# EAGLE design Slave Board (EAGLE 9.0.1)
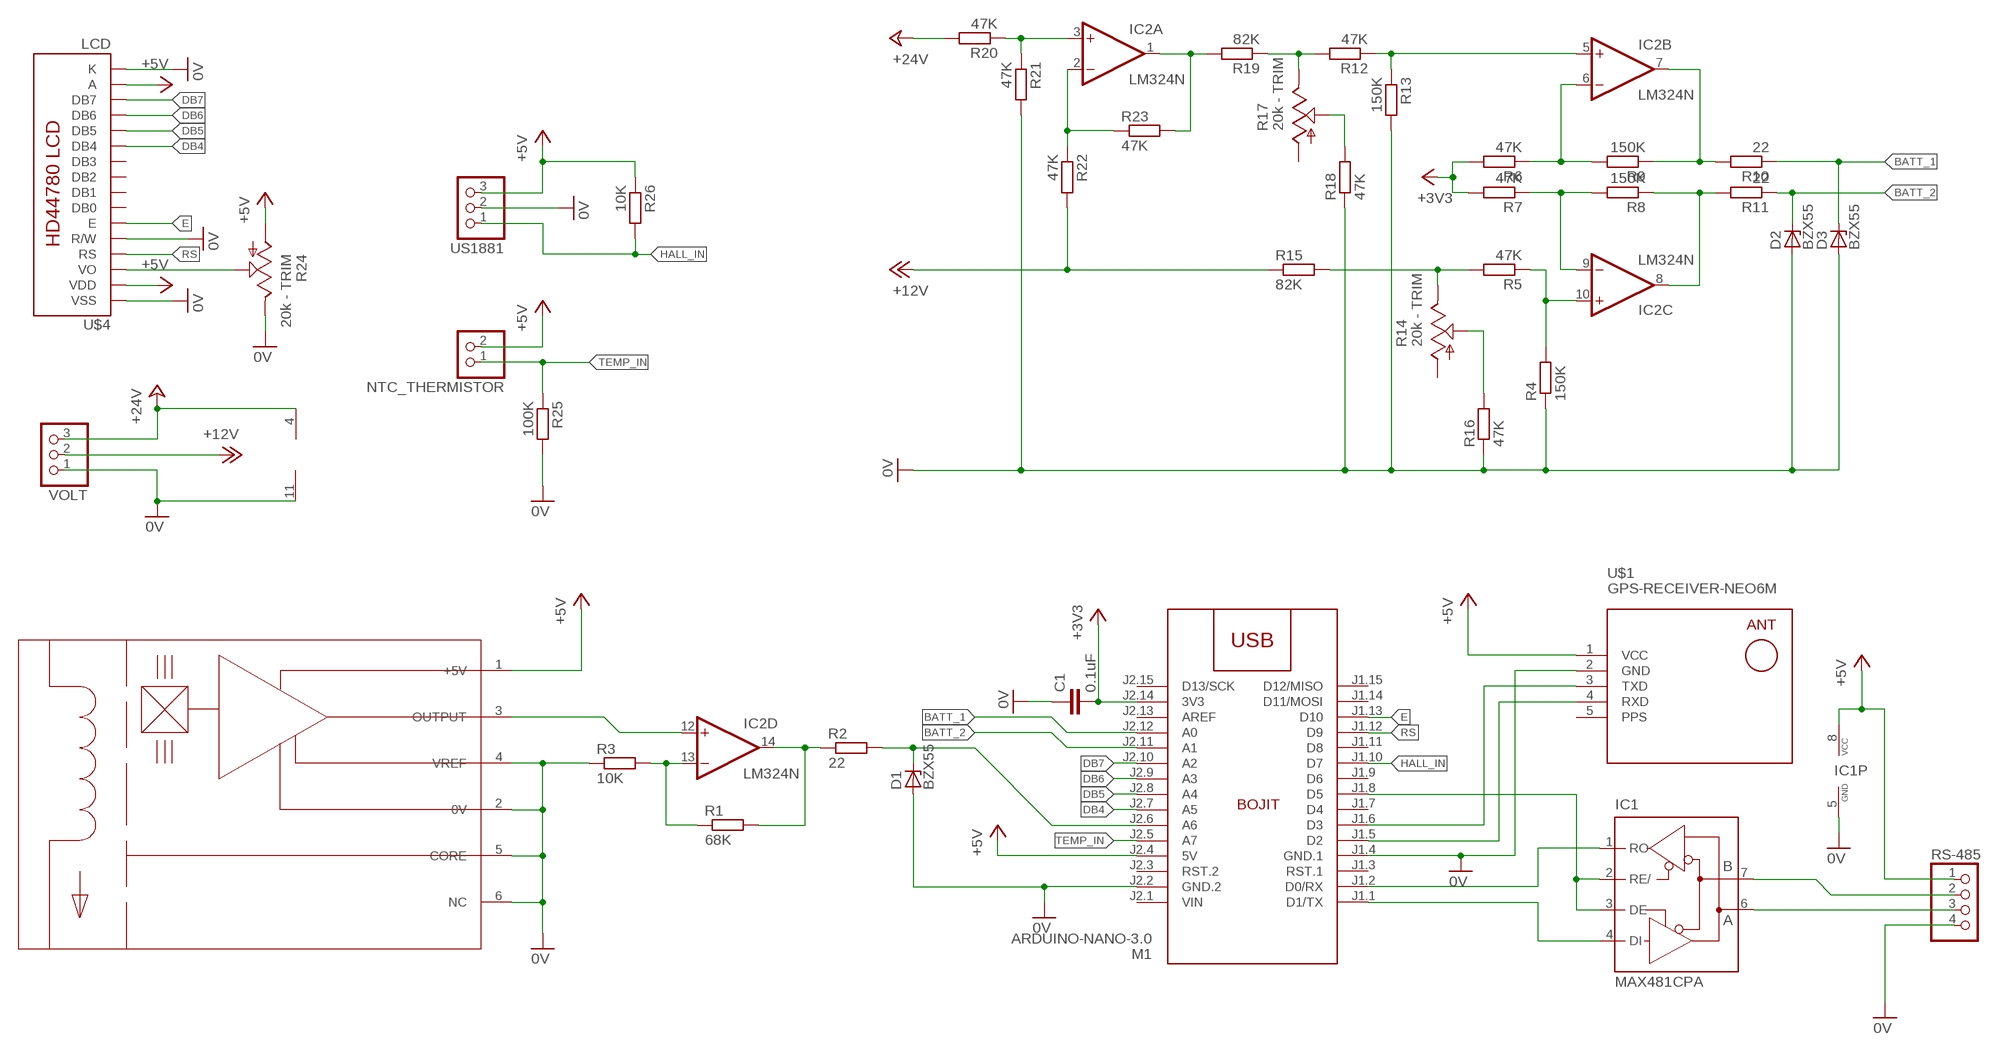
[diagram p0: schematic, sheet 1]

## Parts
C1  0.1uF  C-EU050-030X075  [C050-030X075]
D1  BZX55  [DO35Z10]
D2  BZX55  [DO35Z10]
D3  BZX55  [DO35Z10]
IC1  MAX481CPA  [DIL08]
IC2  LM324N  [DIL14]
M1  ARDUINO-NANO-3.0  [ARDUINO-NANO-3.0]
NTC_THERMISTOR  PINHD-1X2/90  [1X02/90]
R1  68K  R-EU_0204/7  [0204/7]
R2  22  R-EU_0204/7  [0204/7]
R3  10K  R-EU_0204/7  [0204/7]
R4  150K  R-EU_0204/7  [0204/7]
R5  47K  R-EU_0204/7  [0204/7]
R6  47K  R-EU_0204/7  [0204/7]
R7  47K  R-EU_0204/7  [0204/7]
R8  150K  R-EU_0204/7  [0204/7]
R9  150K  R-EU_0204/7  [0204/7]
R10  22  R-EU_0204/7  [0204/7]
R11  22  R-EU_0204/7  [0204/7]
R12  47K  R-EU_0204/7  [0204/7]
R13  150K  R-EU_0204/7  [0204/7]
R14  20k - TRIM  TRIM_US-CA9V  [CA9V]
R15  82K  R-EU_0204/7  [0204/7]
R16  47K  R-EU_0204/7  [0204/7]
R17  20k - TRIM  TRIM_US-CA9V  [CA9V]
R18  47K  R-EU_0204/7  [0204/7]
R19  82K  R-EU_0204/7  [0204/7]
R20  47K  R-EU_0204/7  [0204/7]
R21  47K  R-EU_0204/7  [0204/7]
R22  47K  R-EU_0204/7  [0204/7]
R23  47K  R-EU_0204/7  [0204/7]
R24  20k - TRIM  TRIM_US-CA9V  [CA9V]
R25  100K  R-EU_0204/7  [0204/7]
R26  10K  R-EU_0204/7  [0204/7]
RS-485  PINHD-1X4/90  [1X04/90]
U$1  GPS-RECEIVER-NEO6M  [GPS-RECEIVER-NEO6M]
U$2  LEM_50-P  [LEM_50-P]
U$3  BOJIT_LARGE  [BOJIT_LARGE]
U$4  LCD  LCD-HD447804-HOLES16X2-4-HOLES  [LCD-16X2-4HOLES]
US1881  PINHD-1X3/90  [1X03/90]
VOLT  PINHD-1X3/90  [1X03/90]

## Nets
0V: C1.1 D1.A D2.A D3.A IC1.5(GND) IC2.11(P:V-) M1.J1.4(GND.1) M1.J2.2(GND.2) R3.1 R4.1 R13.2 R16.1 R18.1 R21.2 R24.E R25.2 RS-485.4 U$1.2(GND) U$2.2(0V) U$2.4(VREF) U$2.5(CORE) U$2.6(NC) U$4.1(VSS) U$4.5(R/W) U$4.16(K) US1881.2 VOLT.1
+3V3: C1.2 M1.J2.14(3V3) R6.2 R7.2
+5V: IC1.8(VCC) M1.J2.4(5V) NTC_THERMISTOR.2 R24.A R26.1 RS-485.1 U$1.1(VCC) U$2.1(+5V) U$4.2(VDD) U$4.15(A) US1881.3
+12V: R15.1 R22.2 VOLT.2
+24V: IC2.4(P:V+) R20.2 VOLT.3
BATT_1: D3.C M1.J2.12(A0) R10.1
BATT_2: D2.C M1.J2.11(A1) R11.1
DB4: M1.J2.7(A5) U$4.11(DB4)
DB5: M1.J2.8(A4) U$4.12(DB5)
DB6: M1.J2.9(A3) U$4.13(DB6)
DB7: M1.J2.10(A2) U$4.14(DB7)
E: M1.J1.13(D10) U$4.6(E)
HALL_IN: M1.J1.10(D7) R26.2 US1881.1
N$1: IC1.6(A) RS-485.3
N$2: IC1.7(B) RS-485.2
N$4: R24.S U$4.3(VO)
N$5: IC1.2(RE/) IC1.3(DE) M1.J1.8(D5)
N$6: IC1.1(RO) M1.J1.2(D0/RX)
N$7: IC1.4(DI) M1.J1.1(D1/TX)
N$8: M1.J1.5(D2) U$1.4(RXD)
N$9: M1.J1.6(D3) U$1.3(TXD)
N$10: IC2.13(D:-IN) R1.1 R3.2
N$11: IC2.14(D:OUT) R1.2 R2.1
N$12: IC2.12(D:+IN) U$2.3(OUTPUT)
N$13: D1.C M1.J2.6(A6) R2.2
N$14: IC2.7(B:OUT) R9.1 R10.2
N$15: IC2.8(C:OUT) R8.1 R11.2
N$16: R14.S R16.2
N$17: IC2.9(C:-IN) R7.1 R8.2
N$18: IC2.6(B:-IN) R6.1 R9.2
N$19: IC2.10(C:+IN) R4.2 R5.1
N$20: IC2.5(B:+IN) R12.1 R13.1
N$21: R12.2 R17.E R19.1
N$22: R5.2 R14.E R15.2
N$23: R17.S R18.2
N$24: IC2.1(A:OUT) R19.2 R23.2
N$25: IC2.2(A:-IN) R22.1 R23.1
N$27: IC2.3(A:+IN) R20.1 R21.1
RS: M1.J1.12(D9) U$4.4(RS)
TEMP_IN: M1.J2.5(A7) NTC_THERMISTOR.1 R25.1
Unconnected: M1.J1.3(RST.1) M1.J1.7(D4) M1.J1.9(D6) M1.J1.11(D8) M1.J1.14(D11/MOSI) M1.J1.15(D12/MISO) M1.J2.3(RST.2) M1.J2.13(AREF) M1.J2.15(D13/SCK) R14.A R17.A U$4.7(DB0) U$4.8(DB1) U$4.9(DB2) U$4.10(DB3)

## Power pins joined to a net without a drawn wire
PPS: U$1.5(PPS)
VIN: M1.J2.1(VIN)

## Library data of the parts
C1 = rcl:C-EU: CAPACITOR, European symbol; SPICEPREFIX: C
D1-D3 = diode:BZX55: Z DIODE
IC1 = maxim:MAX481CPA: RS485 TRANSEIVER; MPN: MAX481CPA+; OC_FARNELL: unknown; OC_NEWARK: 99K3445
IC2 = linear:LM324: OP AMP
M1 = diy-modules:ARDUINO-NANO-3.0: Arduino Nano 3.0 and compatible devices More details available here: https://www.arduino.cc/en/Main/ArduinoBoardNano Click here to find device on ebay.com <http://www.ebay.com/sch/arduino+nano>
NTC_THERMISTOR = pinhead:PINHD-1X2: PIN HEADER
R1-R13 R15 R16 R18-R23 R25 R26 = rcl:R-EU_: RESISTOR, European symbol; SPICEPREFIX: R
R14 R17 R24 = pot:TRIM_US-: POTENTIOMETER
RS-485 = pinhead:PINHD-1X4: PIN HEADER
U$1 = diy-modules:GPS-RECEIVER-NEO6M: GPS Receiver Module based on NEO-6 device Short tutorial how to use NEO-6 module with Arduino: http://www.xarg.org/2016/06/neo6mv2-gps-module-with-arduino/ NEO-6 datasheet is available here: https://www.u-blox.com/sites/default/files/products/documents/NEO-6_DataSheet_%28GPS.G6-HW-09005%29.pdf Click here to find device on ebay.com <http://www.ebay.com/sch/gyneo6mv2>
U$2 = LEM_50-P:LEM_50-P
U$3 = BOJIT Logos:BOJIT_LARGE
U$4 = HD44780LCD:LCD-HD44780
US1881 VOLT = pinhead:PINHD-1X3: PIN HEADER

## Board
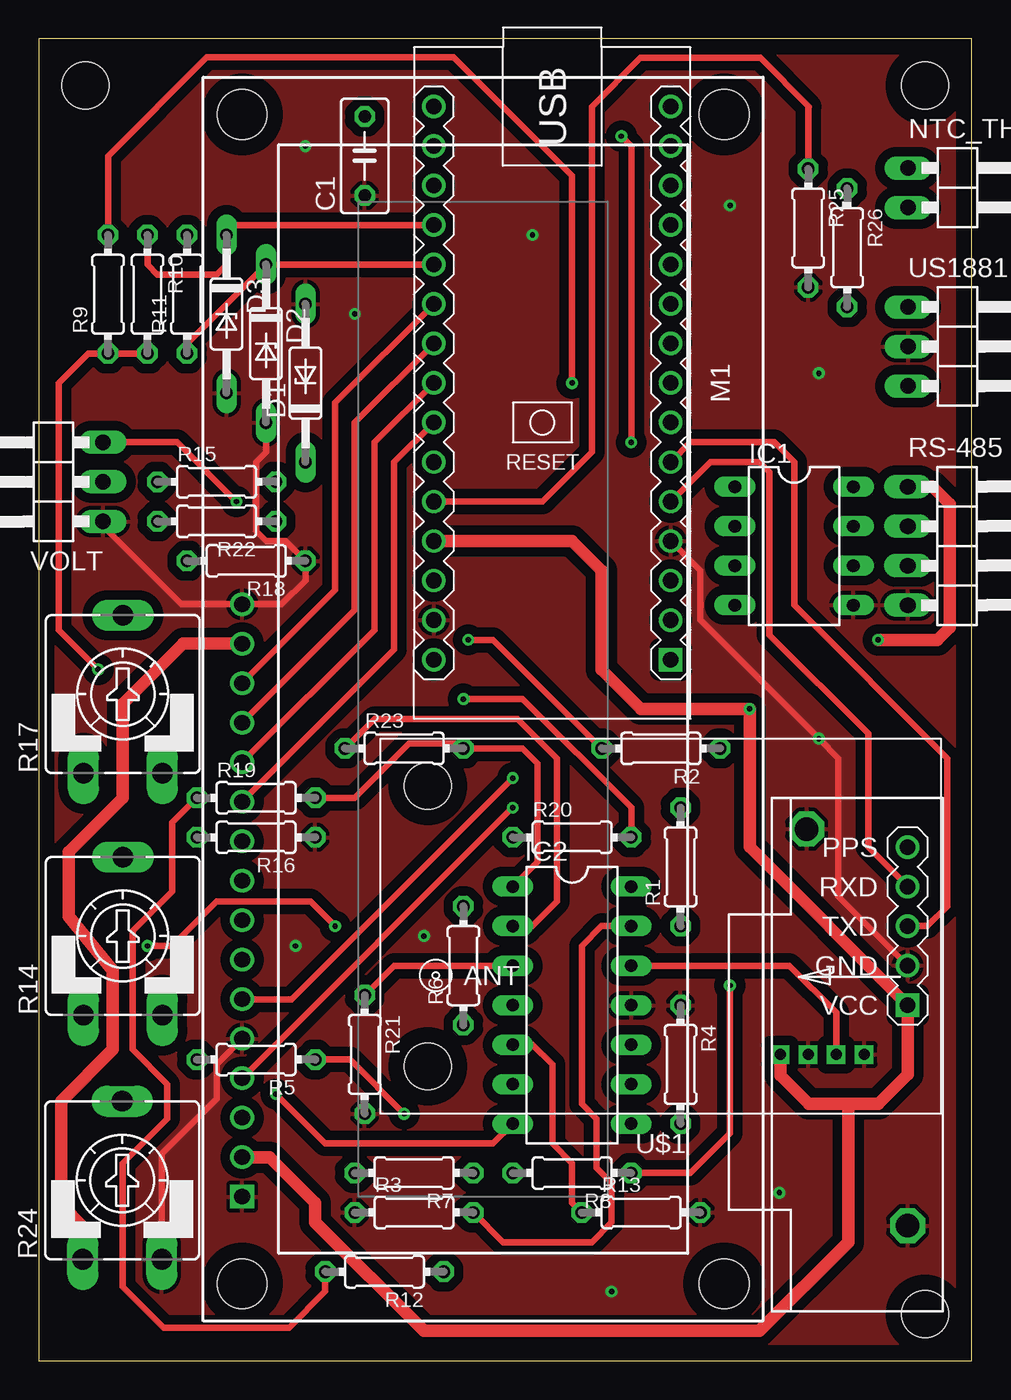
[diagram p1: board, top side]
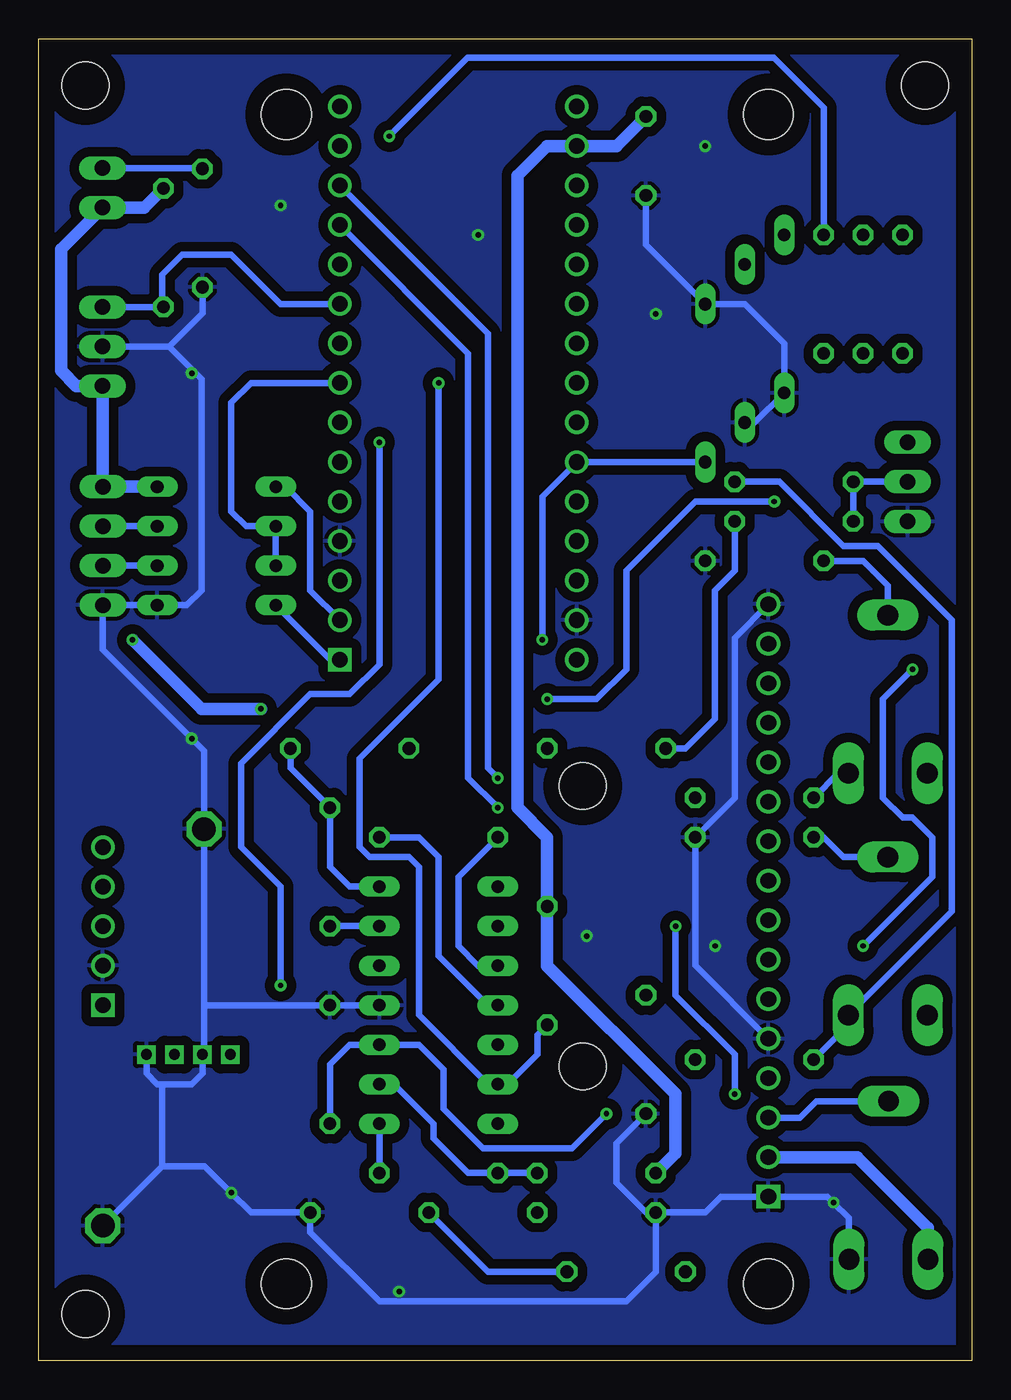
[diagram p2: board, bottom side, seen from below]

Size 60 x 85 mm. Coordinates in mm from the lower left corner, seen from the top.
Outline: 0,0 60,0 60,85 0,85 0,0
Copper layers (1*16): Top 0.035mm / dielectric 1.5mm / Bottom 0.035mm
Design rules "default": minimum track width 6mil, minimum drill 0.35mm, track to track 6mil, track to pad 6mil, pad to pad 6mil, via to via 6mil, smd to smd 6mil, copper to edge 40mil, drill to drill 6mil, minimum pad ring 10mil, minimum via ring 8mil, stop-mask expansion 4mil, vias tented up to drill 0mil, thermal gap 10mil
Holes 3 mm at 3,82 57,3 57,82

### Footprints (pad centres in the part's own frame; a part is rotated, then mirrored left to right if it is on the bottom)
C050-030X075 = drill 0.813 octagon: 1 -2.54,0; 2 2.54,0
DO35Z10 = drill 0.813 long: A 5.08,0; C -5.08,0
DIL08 = drill 0.813 long: 1 -3.81,-3.81; 2 -1.27,-3.81; 3 1.27,-3.81; 4 3.81,-3.81; 5 3.81,3.81; 6 1.27,3.81; 7 -1.27,3.81; 8 -3.81,3.81
DIL14 = drill 0.813 long: 1 -7.62,-3.81; 2 -5.08,-3.81; 3 -2.54,-3.81; 4 0,-3.81; 5 2.54,-3.81; 6 5.08,-3.81; 7 7.62,-3.81; 8 7.62,3.81; 9 5.08,3.81; 10 2.54,3.81; 11 0,3.81; 12 -2.54,3.81; 13 -5.08,3.81; 14 -7.62,3.81
ARDUINO-NANO-3.0 = drill 1 square: J1.1 17.78,7.62 | drill 1: J1.2 15.24,7.62; J1.3 12.7,7.62; J1.4 10.16,7.62; J1.5 7.62,7.62; J1.6 5.08,7.62; J1.7 2.54,7.62; J1.8 0,7.62; J1.9 -2.54,7.62; J1.10 -5.08,7.62; J1.11 -7.62,7.62; J1.12 -10.16,7.62; J1.13 -12.7,7.62; J1.14 -15.24,7.62; J1.15 -17.78,7.62; J2.1 17.78,-7.62; J2.2 15.24,-7.62; J2.3 12.7,-7.62; J2.4 10.16,-7.62; J2.5 7.62,-7.62; J2.6 5.08,-7.62; J2.7 2.54,-7.62; J2.8 0,-7.62; J2.9 -2.54,-7.62; J2.10 -5.08,-7.62; J2.11 -7.62,-7.62; J2.12 -10.16,-7.62; J2.13 -12.7,-7.62; J2.14 -15.24,-7.62; J2.15 -17.78,-7.62
1X02/90 = drill 1.016 long: 1 -1.27,-3.81; 2 1.27,-3.81
0204/7 = drill 0.813 octagon: 1 -3.81,0; 2 3.81,0
CA9V = drill 1.321 long: A -2.54,-5.08; E 2.54,-5.08; S 0,5.08
1X04/90 = drill 1.016 long: 1 -3.81,-3.81; 2 -1.27,-3.81; 3 1.27,-3.81; 4 3.81,-3.81
GPS-RECEIVER-NEO6M = drill 1 square: 1 -15.875,5.08 | drill 1: 2 -15.875,2.54; 3 -15.875,0; 4 -15.875,-2.54; 5 -15.875,-5.08 | hole 3: 14.986,-9.017; 14.986,9.017
LEM_50-P = drill 0.7 square: 1 0,8.2; 2 0,6.4; 3 0,4.6; 4 0,2.8 | drill 1.5 octagon: 5 -11,0; 6 14.5,6.5
LCD-16X2-4HOLES = drill 1.016 square: 1 -32,15.5 | drill 1.016: 2 -29.46,15.5; 3 -26.92,15.5; 4 -24.38,15.5; 5 -21.84,15.5; 6 -19.3,15.5; 7 -16.76,15.5; 8 -14.22,15.5; 9 -11.68,15.5; 10 -9.14,15.5; 11 -6.6,15.5; 12 -4.06,15.5; 13 -1.52,15.5; 14 1.02,15.5; 15 3.56,15.5; 16 6.1,15.5 | hole 3.2: -37.6,15.5; -37.6,-15.5; 37.6,-15.5; 37.6,15.5
1X03/90 = drill 1.016 long: 1 -2.54,-3.81; 2 0,-3.81; 3 2.54,-3.81

### Placement (x,y rotation side)
C1  20.95,77.47 90 top
D1  17.14,62.87 90 top
D2  14.61,65.41 270 top
D3  12.06,67.31 270 top
IC1  48.58,52.39 270 top
IC2  34.29,22.86 270 top
M1  33.02,62.87 270 top
NTC_THERMISTOR  59.72,75.43 270 top
R1  41.27,31.75 90 top
R2  40.01,39.37 180 top
R3  24.13,9.53 0 top
R4  41.27,19.05 270 top
R5  13.97,19.37 180 top
R6  27.3,25.4 90 top
R7  24.13,12.06 180 top
R8  34.29,12.06 180 top
R9  4.45,68.58 90 top
R10  6.99,68.58 270 top
R11  9.53,68.58 90 top
R12  22.23,5.71 180 top
R13  38.73,9.53 0 top
R14  5.4,27.3 0 top
R15  11.43,56.52 0 top
R16  13.97,33.66 180 top
R17  5.4,42.86 0 top
R18  13.34,51.44 180 top
R19  13.97,36.2 0 top
R20  34.29,33.66 0 top
R21  20.95,19.68 270 top
R22  11.43,53.98 180 top
R23  23.5,39.37 0 top
R24  5.36,11.6 0 top
R25  49.48,72.84 270 top
R26  51.99,71.57 270 top
RS-485  59.69,52.39 270 top
U$1  40.01,27.94 180 top
U$2  55.88,19.68 90 top
U$3  56.52,3.81 90 top
U$4  28.57,42.55 90 top
US1881  59.72,65.22 270 top
VOLT  0.32,56.52 90 top

### Tracks (layer width: path | path; a pad name or v marks a point on that pad's centre or on a via)
0V  (via drill 0.35)
  Top 0.406: VOLT.1 4.13,53.66 9.14,48.65 U$4.16 15.62,48.65 17.14,50.16 R18.1 15.88,52.7 14.61,52.7 13.97,53.34 13.97,57.78 14.61,58.42 D2.A | U$4.5 11.43,19.06 11.43,16.83 7.9,13.3 R24.E | U$1.2 51.44,29.84 51.44,38.73 v50.16,40.01 42.55,47.62 42.55,50.8 M1.J1.4
  Bottom 0.406: 51.62,65.22 US1881.2 | R25.2 49.48,67.36 51.62,65.22 | C1.1 20.95,71.75 D1.A 14.61,67.94 12.06,65.41 D3.A 13.97,60.33 D2.A | 49.38,22.86 U$2.6 49.38,39.22 v50.16,40.01 55.88,45.72 RS-485.4 IC1.5 50.48,48.58 49.53,49.53 49.53,63.13 51.62,65.22 | 49.38,22.86 49.38,19.79 U$2.2 49.48,18.46 50.16,17.78 52.07,17.78 | U$2.4 53.08,18.47 52.39,17.78 52.07,17.78 | 49.38,22.86 R4.1 IC2.11 | U$2.5 52.07,12.49 | 52.07,12.49 52.07,17.78 | 52.07,12.49 49.33,12.49 v47.62,10.79 46.35,9.53 R13.2 42.55,8.26 38.1,3.81 22.23,3.81 20.32,5.71 R3.1 | R24.E 7.9,9.17 v8.89,10.16 9.28,10.54 U$4.1 16.12,10.54 17.14,9.53 R3.1 | R3.1 20.95,9.53 22.86,11.43 22.86,13.97 R21.2 | U$4.5 17.78,25.41 R16.1 15.24,36.2 15.24,46.48 U$4.16
  other vias: 16.51,26.67 36.83,4.45 50.16,63.5 44.45,74.3 31.75,72.39 17.14,78.11 20.32,67.31 24.77,27.3
  pour Top (isolate 0.61): 0,85.64 60,85.64 60,0 0,0
  pour Bottom (isolate 0.61): 0,85.64 60,85.64 60,0 0,0
+3V3
  Bottom 0.813: C1.2 22.86,78.11 M1.J2.14 27.3,78.11 29.21,76.2 29.21,35.56 27.3,33.66 R6.2 27.3,25.4 19.05,17.14 19.05,13.34 R7.2
+5V  (via drill 0.35)
  Top 0.813: U$2.1 47.68,18.36 49.53,16.51 52.07,16.51 | 52.07,16.51 53.98,16.51 55.88,18.41 U$1.1 45.72,33.02 v45.72,41.91 38.73,41.91 36.2,44.45 36.2,50.8 34.29,52.7 M1.J2.4 | v53.98,46.35 57.78,46.35 58.58,47.15 58.58,55.09 57.47,56.2 RS-485.1 | U$4.15 9.28,46.1 5.4,42.23 5.4,36.2 1.91,32.7 1.91,28.57 4.76,25.08 4.76,20 1.42,16.66 1.42,10.01 2.86,8.57 2.86,6.55 R24.A | U$4.2 14.86,13.09 17.78,10.16 17.78,8.89 24.77,1.91 46.35,1.91 52.07,7.62 52.07,16.51
  Bottom 0.813: IC1.8 RS-485.1 55.91,56.22 US1881.3 57.6,62.68 58.58,63.66 58.58,71.49 NTC_THERMISTOR.2 53.21,74.16 R26.1 | U$4.2 7.37,13.09 2.82,8.54 R24.A | v53.98,46.35 49.53,41.91 v45.72,41.91
+12V
  Bottom 0.406: VOLT.2 R15.1 R22.2
+24V  (via drill 0.35)
  Top 0.406: VOLT.3 8.89,59.05 v12.7,55.24 | v27.3,42.55 31.11,42.55 38.1,35.56 R20.2
  Bottom 0.406: IC2.4 31.11,22.86 34.29,26.04 34.29,32.38 35.56,33.66 R20.2 | v27.3,42.55 24.13,42.55 22.23,44.45 22.23,50.8 17.78,55.24 v12.7,55.24
BATT_1
  Top 0.406: M1.J2.12 12.7,73.03 D3.C 12.06,70.48 11.43,69.85 7.62,69.85 6.99,70.48 R10.1
BATT_2
  Top 0.406: M1.J2.11 D2.C 9.53,65.41 R11.1
DB4
  Top 0.406: M1.J2.7 22.86,57.78 22.86,45.73 U$4.11
DB5
  Top 0.406: U$4.12 21.59,47 21.59,59.05 M1.J2.8
DB6
  Top 0.406: U$4.13 20.32,48.27 20.32,60.33 M1.J2.9
DB7
  Top 0.406: U$4.14 19.05,49.54 19.05,61.59 M1.J2.10
E  (via drill 0.35)
  Top 0.406: U$4.6 16.26,23.25 v30.48,37.47
  Bottom 0.406: M1.J1.13 31.11,66.04 31.11,38.1 v30.48,37.47
HALL_IN
  Bottom 0.406: R26.2 52.07,67.76 | 52.07,67.76 US1881.1 | M1.J1.10 44.45,67.94 47.62,71.12 50.8,71.12 52.07,69.85 52.07,67.76
N$1
  Bottom 0.406: IC1.6 RS-485.3
N$2
  Bottom 0.406: IC1.7 RS-485.2
N$4
  Bottom 0.406: U$4.3 11.04,15.62 9.99,16.68 R24.S
N$5
  Bottom 0.406: IC1.3 IC1.2 46.67,53.66 47.62,54.61 47.62,61.59 46.35,62.87 M1.J1.8
N$6
  Bottom 0.406: M1.J1.2 42.55,49.53 42.55,54.61 44.13,56.2 IC1.1
N$7
  Bottom 0.406: IC1.4 41.27,45.09 M1.J1.1
N$8
  Top 0.406: U$1.4 53.34,33.02 53.34,40.32 46.99,46.67 46.99,57.15 46.35,57.78 43.18,57.78 M1.J1.5
N$9
  Top 0.406: M1.J1.6 41.91,59.05 47.31,59.05 48.58,57.78 48.58,48.58 58.42,38.73 58.42,29.21 57.15,27.94 U$1.3
N$10
  Top 0.406: R3.2 29.84,7.62 35.56,7.62 36.83,8.89 36.83,11.43 35.88,12.38 35.88,15.56 34.92,16.51 34.92,26.67 36.2,27.94 IC2.13
  Bottom 0.406: R1.1 IC2.13
N$11
  Bottom 0.406: IC2.14 40.01,30.48 41.27,31.75 R1.2 43.81,38.1 R2.1
N$12
  Top 0.406: U$2.3 51.28,22.38 48.26,25.4 IC2.12
N$13  (via drill 0.35)
  Top 0.406: v27.62,46.35 29.21,46.35 R2.2
  Bottom 0.406: D1.C M1.J2.6 27.62,55.56 v27.62,46.35
N$14  (via drill 0.35)
  Top 0.406: R10.2 R9.1 3.17,64.77 1.27,62.87 1.27,46.99 v3.81,44.45 | IC2.7 29.21,13.97 18.41,13.97 v15.24,17.14 | v19.05,27.94 17.46,29.53 11.43,29.53 8.57,26.67 v6.99,26.67
  Bottom 0.406: v3.81,44.45 5.71,42.55 5.71,36.2 4.45,34.92 3.81,34.92 2.54,33.66 2.54,31.11 v6.99,26.67 | v15.24,17.14 15.24,19.68 19.05,23.5 v19.05,27.94
N$15  (via drill 0.35)
  Top 0.406: R8.1 41.91,12.06 44.45,14.61 v44.45,24.13 | v38.1,59.05 38.1,78.11 v37.47,78.74
  Bottom 0.406: R8.1 IC2.8 | v44.45,24.13 44.45,30.48 46.99,33.02 46.99,38.42 42.55,42.86 40.01,42.86 38.1,44.77 v38.1,59.05 | v37.47,78.74 32.42,83.78 12.72,83.78 9.53,80.58 R11.2
N$16
  Bottom 0.406: R16.2 9.53,33.66 8.26,32.38 R14.S
N$17
  Bottom 0.406: IC2.9 37.15,17.78 34.61,15.24 34.61,14.29 32.38,12.06 R8.2 R7.1
N$18  (via drill 0.35)
  Top 0.406: v34.29,62.87 34.29,76.2 26.67,83.82 10.79,83.82 4.45,77.47 R9.2
  Bottom 0.406: R6.1 27.94,20.95 27.94,19.68 29.84,17.78 IC2.6 31.11,17.78 35.56,22.23 35.56,31.75 36.2,32.38 38.73,32.38 39.37,33.02 39.37,38.73 34.29,43.81 v34.29,62.87
N$19  (via drill 0.35)
  Top 0.406: R5.1 20,19.37 v23.5,15.88
  Bottom 0.406: R4.2 41.27,19.05 40.01,20.32 IC2.10 35.56,20.32 33.97,18.73 33.97,16.19 31.43,13.65 25.72,13.65 v23.5,15.88
N$20
  Top 0.406: R13.1 34.29,10.16 34.29,12.7 33.02,13.97 33.02,19.05 31.75,20.32 IC2.5
  Bottom 0.406: R13.1 31.11,5.71 R12.1
N$21
  Top 0.406: R19.1 8.57,34.61 8.57,30.16 6.03,27.62 6.03,20 8.26,17.78 8.26,15.56 5.4,12.7 5.4,4.76 8.03,2.13 16.1,2.13 18.41,4.45 R12.2
  Bottom 0.406: R19.1 8.57,37.78 R17.E
N$22
  Bottom 0.406: R5.2 7.94,21.59 R14.E 1.27,28.89 1.27,47.62 6.03,52.39 8.26,52.39 12.38,56.52 R15.2
N$23
  Bottom 0.406: R17.S 5.4,49.85 6.99,51.44 R18.2
N$24
  Top 0.406: R19.2 20.32,36.2 23.8,39.68 27,39.68 R23.2 31.11,39.37 32.07,38.42 32.07,32.07 IC2.1
N$25
  Top 0.406: R23.1 21.59,41.27 30.8,41.27 33.34,38.73 33.34,29.53 31.75,27.94 IC2.2
  Bottom 0.406: R23.1 18.41,39.37 16.51,41.27 16.51,49.53 15.24,50.8 R22.1
N$27
  Top 0.406: R21.1 22.86,25.4 IC2.3
  Bottom 0.406: R20.1 33.02,31.11 33.02,26.67 31.75,25.4 IC2.3
RS  (via drill 0.35)
  Top 0.406: U$4.4 v30.47,35.56 v30.48,35.56
  Bottom 0.406: M1.J1.12 32.38,64.77 32.38,37.47 v30.48,35.56
TEMP_IN
  Top 0.406: M1.J2.5 32.38,55.24 35.56,58.42 35.56,80.64 38.7,83.78 46.39,83.78 49.53,80.64 49.48,80.59 R25.1 49.34,76.65
  Bottom 0.406: NTC_THERMISTOR.1 49.53,76.7 R25.1